# Altium schematic sheet Pg04_ AM335X Section 3 .SchDoc: PROCESSOR 3 OF 3
size A2; DrawnBy: RvS; DocumentNumber: 4; SheetNumber: 4; SheetTotal: 16
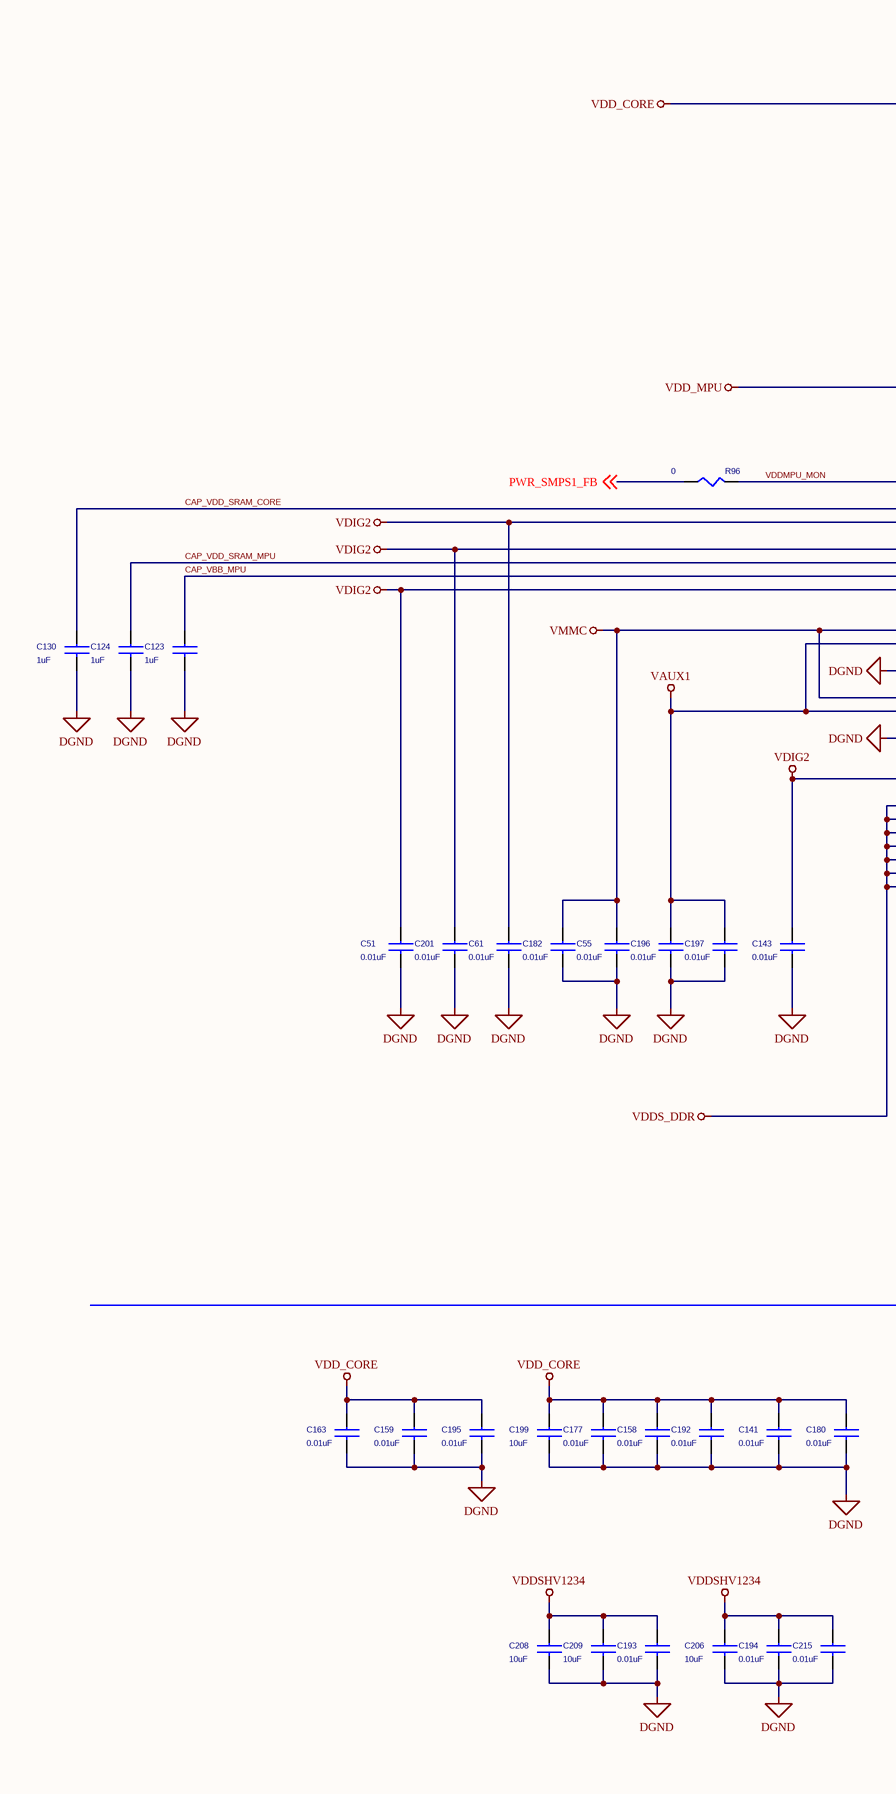
[diagram p0: Pg04_ AM335X Section 3 .SchDoc, left]
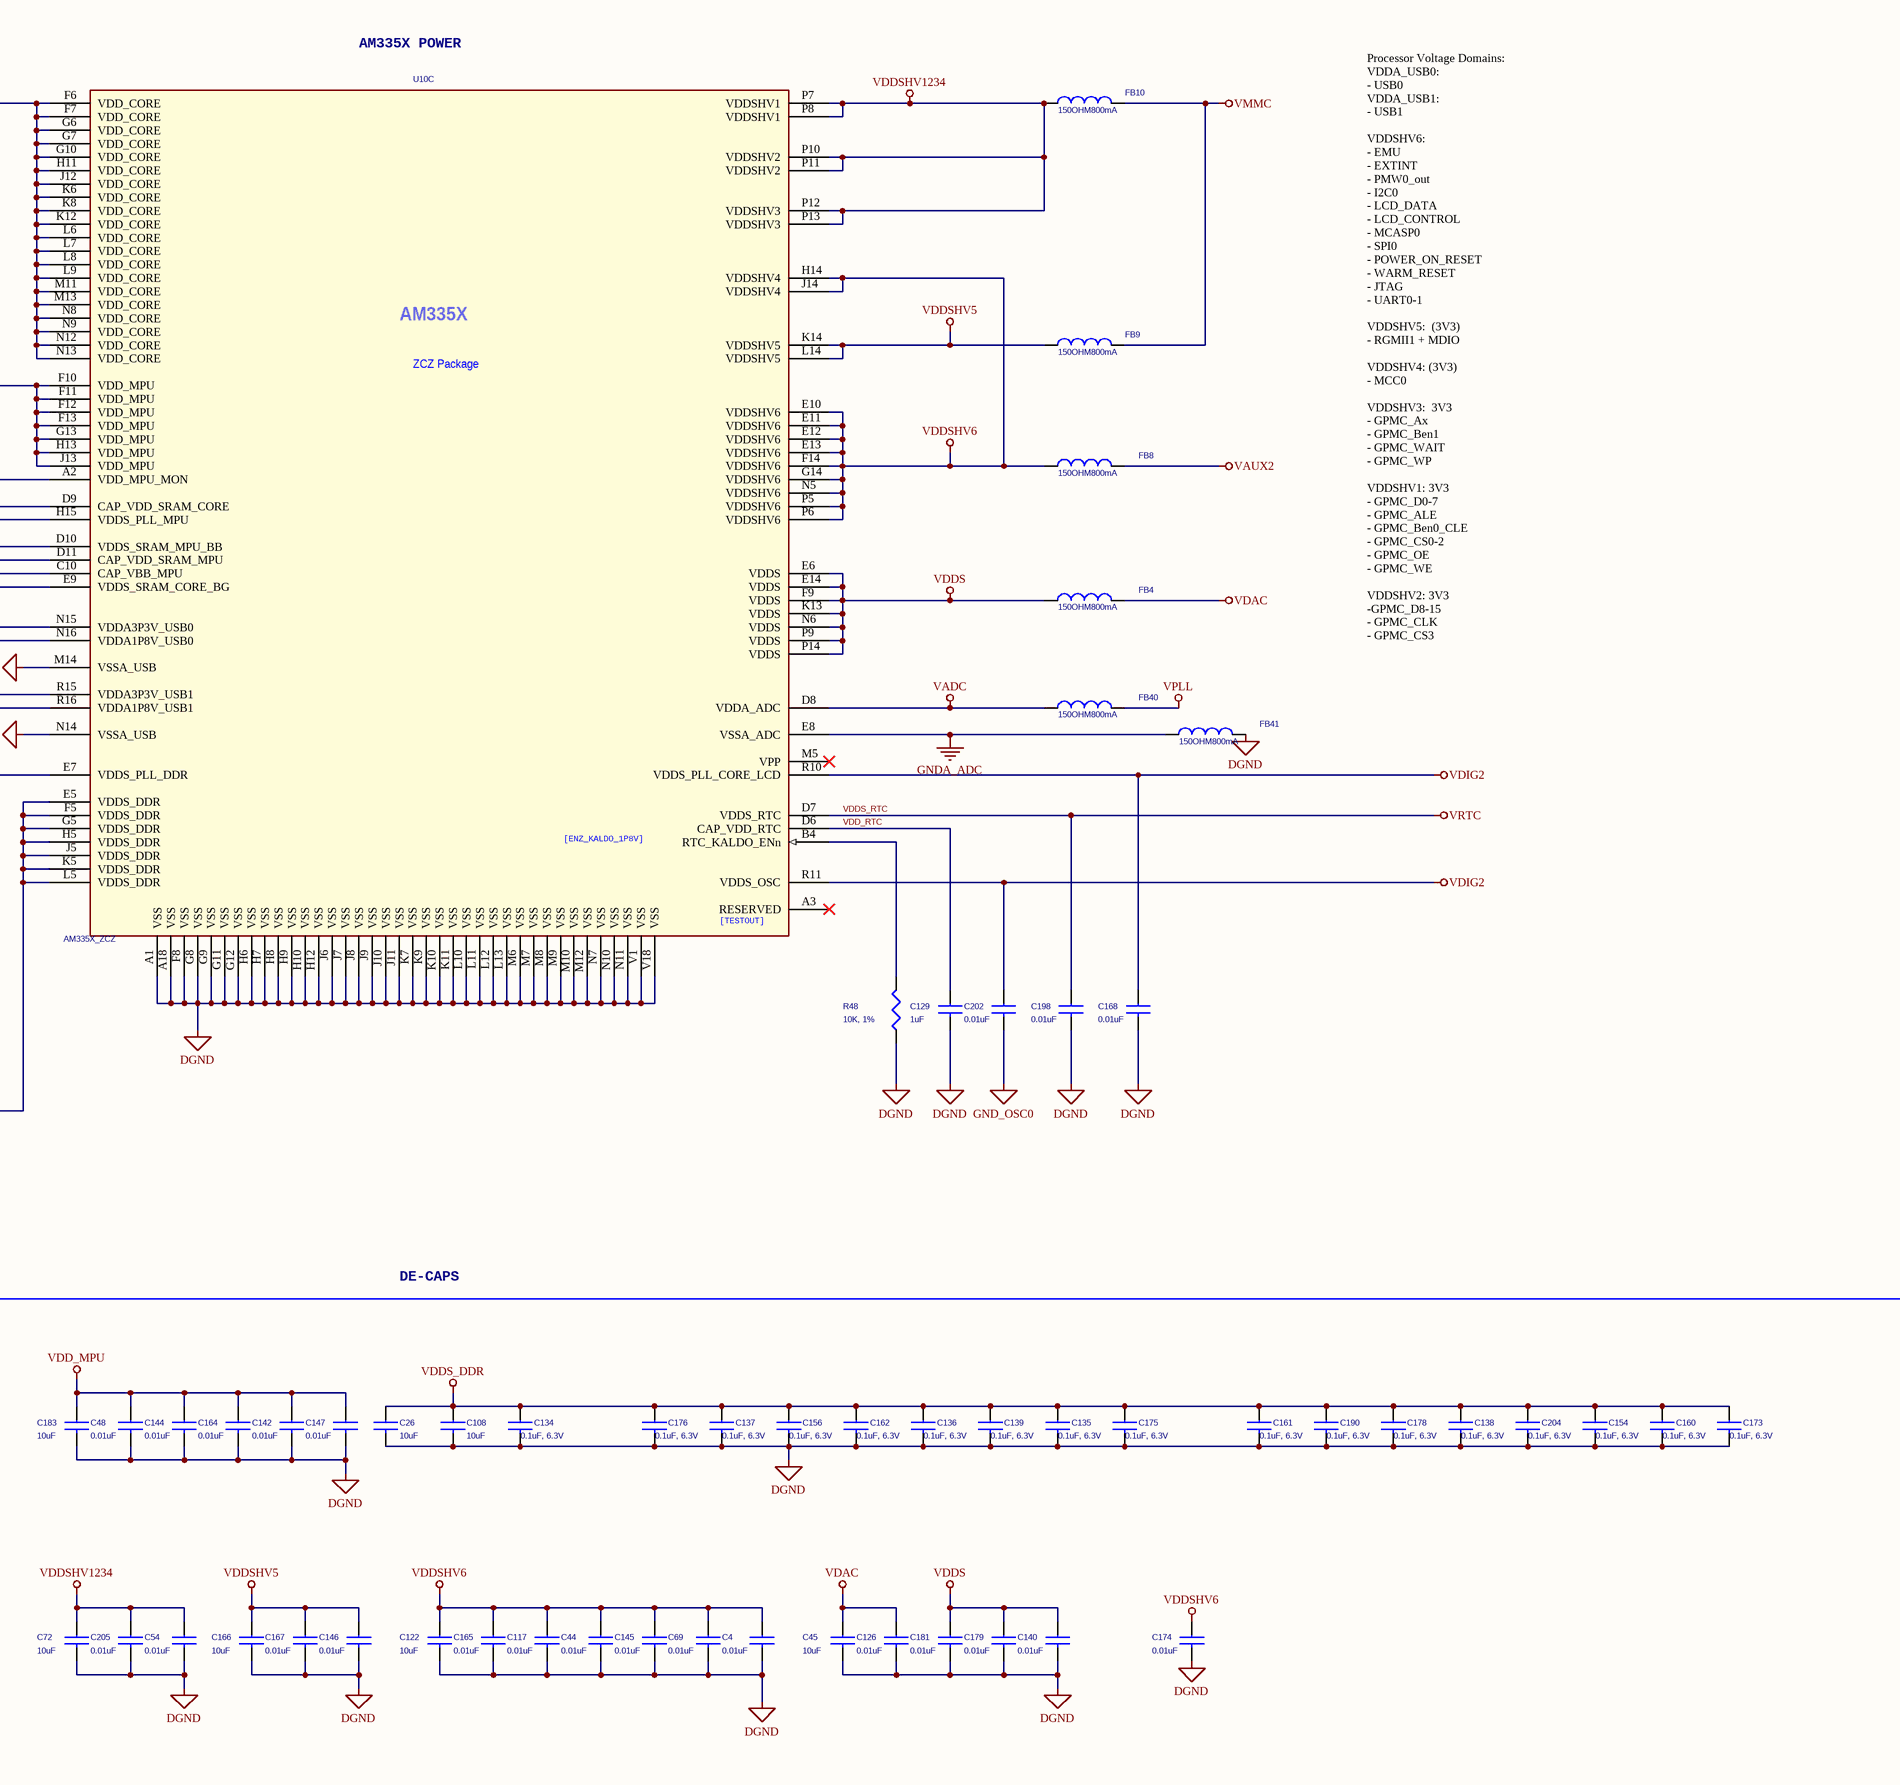
[diagram p1: Pg04_ AM335X Section 3 .SchDoc, right]

## Parts
?  (no value)  (graphical)
C4  0.01uF  [SM-7351-CAP-0402]
C26  10uF  [SM-7351-CAP-0805]
C44  0.01uF  [SM-7351-CAP-0402]
C45  10uF  [SM-7351-CAP-0805]
C48  0.01uF  [SM-7351-CAP-0402]
C51  0.01uF  [SM-7351-CAP-0402]
C54  0.01uF  [SM-7351-CAP-0402]
C55  0.01uF  [SM-7351-CAP-0402]
C61  0.01uF  [SM-7351-CAP-0402]
C69  0.01uF  [SM-7351-CAP-0402]
C72  10uF  [SM-7351-CAP-0805]
C108  10uF  [SM-7351-CAP-0805]
C117  0.01uF  [SM-7351-CAP-0402]
C122  10uF  [SM-7351-CAP-0805]
C123  1uF  [SM-7351-CAP-0402]
C124  1uF  [SM-7351-CAP-0402]
C126  0.01uF  [SM-7351-CAP-0402]
C129  1uF  [SM-7351-CAP-0402]
C130  1uF  [SM-7351-CAP-0402]
C134  0.1uF, 6.3V  [SM-7351-CAP-0402]
C135  0.1uF, 6.3V  [SM-7351-CAP-0402]
C136  0.1uF, 6.3V  [SM-7351-CAP-0402]
C137  0.1uF, 6.3V  [SMD0201]
C138  0.1uF, 6.3V  [SMD0201]
C139  0.1uF, 6.3V  [SMD0201]
C140  0.01uF  [SM-7351-CAP-0402]
C141  0.01uF  [SM-7351-CAP-0402]
C142  0.01uF  [SM-7351-CAP-0402]
C143  0.01uF  [SM-7351-CAP-0402]
C144  0.01uF  [SM-7351-CAP-0402]
C145  0.01uF  [SM-7351-CAP-0402]
C146  0.01uF  [SM-7351-CAP-0402]
C147  0.01uF  [SM-7351-CAP-0402]
C154  0.1uF, 6.3V  [SMD0201]
C156  0.1uF, 6.3V  [SMD0201]
C158  0.01uF  [SM-7351-CAP-0402]
C159  0.01uF  [SM-7351-CAP-0402]
C160  0.1uF, 6.3V  [SMD0201]
C161  0.1uF, 6.3V  [SMD0201]
C162  0.1uF, 6.3V  [SMD0201]
C163  0.01uF  [SM-7351-CAP-0402]
C164  0.01uF  [SM-7351-CAP-0402]
C165  0.01uF  [SM-7351-CAP-0402]
C166  10uF  [SM-7351-CAP-0805]
C167  0.01uF  [SM-7351-CAP-0402]
C168  0.01uF  [SM-7351-CAP-0402]
C173  0.1uF, 6.3V  [SMD0201]
C174  0.01uF  [SM-7351-CAP-0402]
C175  0.1uF, 6.3V  [SMD0201]
C176  0.1uF, 6.3V  [SMD0201]
C177  0.01uF  [SM-7351-CAP-0402]
C178  0.1uF, 6.3V  [SMD0201]
C179  0.01uF  [SM-7351-CAP-0402]
C180  0.01uF  [SM-7351-CAP-0402]
C181  0.01uF  [SM-7351-CAP-0402]
C182  0.01uF  [SM-7351-CAP-0402]
C183  10uF  [SM-7351-CAP-0805]
C190  0.1uF, 6.3V  [SM-7351-CAP-0402]
C192  0.01uF  [SM-7351-CAP-0402]
C193  0.01uF  [SM-7351-CAP-0402]
C194  0.01uF  [SM-7351-CAP-0402]
C195  0.01uF  [SM-7351-CAP-0402]
C196  0.01uF  [SM-7351-CAP-0402]
C197  0.01uF  [SM-7351-CAP-0402]
C198  0.01uF  [SM-7351-CAP-0402]
C199  10uF  [SM-7351-CAP-0805]
C201  0.01uF  [SM-7351-CAP-0402]
C202  0.01uF  [SM-7351-CAP-0402]
C204  0.1uF, 6.3V  [SM-7351-CAP-0402]
C205  0.01uF  [SM-7351-CAP-0402]
C206  10uF  [SM-7351-CAP-0805]
C208  10uF  [SM-7351-CAP-0805]
C209  10uF  [SM-7351-CAP-0805]
C215  0.01uF  [SM-7351-CAP-0402]
FB4  150OHM800mA  [sm-7351-ind-0805]
FB8  150OHM800mA  [sm-7351-ind-0805]
FB9  150OHM800mA  [sm-7351-ind-0805]
FB10  150OHM800mA  [sm-7351-ind-0805]
FB40  150OHM800mA  [sm-7351-ind-0805]
FB41  150OHM800mA  [sm-7351-ind-0805]
R48  10K, 1%  [SM-7351-RES-0402]
R96  0  [SM-7351-RES-0402]
U10  AM335X_ZCZ  [BGA15X15-324-55M]  (part C of 3)

## Nets
DGND: C4.2 C26.2 C44.2 C45.2 C48.2 C51.2 C54.2 C55.2 C61.2 C69.2 C72.2 C108.2 C117.2 C122.2 C123.2 C124.2 C126.2 C129.2 C130.2 C134.2 C135.2 C136.2 C137.2 C138.2 C139.2 C140.2 C141.2 C142.2 C143.2 C144.2 C145.2 C146.2 C147.2 C154.2 C156.2 C158.2 C159.2 C160.2 C161.2 C162.2 C163.2 C164.2 C165.2 C166.2 C167.2 C168.2 C173.2 C174.2 C175.2 C176.2 C177.2 C178.2 C179.2 C180.2 C181.2 C182.2 C183.2 C190.2 C192.2 C193.2 C194.2 C195.2 C196.2 C197.2 C198.2 C199.2 C201.2 C204.2 C205.2 C206.2 C208.2 C209.2 C215.2 FB41.2 R48.1 U10.A1(VSS) U10.A18(VSS) U10.F8(VSS) U10.G8(VSS) U10.G9(VSS) U10.G11(VSS) U10.G12(VSS) U10.H6(VSS) U10.H7(VSS) U10.H8(VSS) U10.H9(VSS) U10.H10(VSS) U10.H12(VSS) U10.J6(VSS) U10.J7(VSS) U10.J8(VSS) U10.J9(VSS) U10.J10(VSS) U10.J11(VSS) U10.K7(VSS) U10.K9(VSS) U10.K10(VSS) U10.K11(VSS) U10.L10(VSS) U10.L11(VSS) U10.L12(VSS) U10.L13(VSS) U10.M6(VSS) U10.M7(VSS) U10.M8(VSS) U10.M9(VSS) U10.M10(VSS) U10.M12(VSS) U10.M14(VSSA_USB) U10.N7(VSS) U10.N10(VSS) U10.N11(VSS) U10.N14(VSSA_USB) U10.V1(VSS) U10.V18(VSS)
GND_OSC0: C202.2
GNDA_ADC: FB41.1 U10.E8(VSSA_ADC)
VADC: FB40.1 U10.D8(VDDA_ADC)
VAUX1: C196.1 C197.1 U10.N16(VDDA1P8V_USB0) U10.R16(VDDA1P8V_USB1)
VAUX2: FB8.2
VDAC: C45.1 C126.1 FB4.2
VDD_CORE: C141.1 C158.1 C159.1 C163.1 C177.1 C180.1 C192.1 C195.1 C199.1 U10.F6(VDD_CORE) U10.F7(VDD_CORE) U10.G6(VDD_CORE) U10.G7(VDD_CORE) U10.G10(VDD_CORE) U10.H11(VDD_CORE) U10.J12(VDD_CORE) U10.K6(VDD_CORE) U10.K8(VDD_CORE) U10.K12(VDD_CORE) U10.L6(VDD_CORE) U10.L7(VDD_CORE) U10.L8(VDD_CORE) U10.L9(VDD_CORE) U10.M11(VDD_CORE) U10.M13(VDD_CORE) U10.N8(VDD_CORE) U10.N9(VDD_CORE) U10.N12(VDD_CORE) U10.N13(VDD_CORE)
VDD_MPU: C48.1 C142.1 C144.1 C147.1 C164.1 C183.1 U10.F10(VDD_MPU) U10.F11(VDD_MPU) U10.F12(VDD_MPU) U10.F13(VDD_MPU) U10.G13(VDD_MPU) U10.H13(VDD_MPU) U10.J13(VDD_MPU)
VDDS: C140.1 C179.1 C181.1 FB4.1 U10.E6(VDDS) U10.E14(VDDS) U10.F9(VDDS) U10.K13(VDDS) U10.N6(VDDS) U10.P9(VDDS) U10.P14(VDDS)
VDDS_DDR: C26.1 C108.1 C134.1 C135.1 C136.1 C137.1 C138.1 C139.1 C154.1 C156.1 C160.1 C161.1 C162.1 C173.1 C175.1 C176.1 C178.1 C190.1 C204.1 U10.E5(VDDS_DDR) U10.F5(VDDS_DDR) U10.G5(VDDS_DDR) U10.H5(VDDS_DDR) U10.J5(VDDS_DDR) U10.K5(VDDS_DDR) U10.L5(VDDS_DDR)
VDDS_RTC: C198.1 U10.D7(VDDS_RTC)  [also labelled VRTC]
VDDSHV5: C146.1 C166.1 C167.1 FB9.1 U10.K14(VDDSHV5) U10.L14(VDDSHV5)
VDDSHV6: C4.1 C44.1 C69.1 C117.1 C122.1 C145.1 C165.1 C174.1 FB8.1 U10.E10(VDDSHV6) U10.E11(VDDSHV6) U10.E12(VDDSHV6) U10.E13(VDDSHV6) U10.F14(VDDSHV6) U10.G14(VDDSHV6) U10.H14(VDDSHV4) U10.J14(VDDSHV4) U10.N5(VDDSHV6) U10.P5(VDDSHV6) U10.P6(VDDSHV6)
VDDSHV1234: C54.1 C72.1 C193.1 C194.1 C205.1 C206.1 C208.1 C209.1 C215.1 FB10.1 U10.P7(VDDSHV1) U10.P8(VDDSHV1) U10.P10(VDDSHV2) U10.P11(VDDSHV2) U10.P12(VDDSHV3) U10.P13(VDDSHV3)
VDIG2: C51.1 C61.1 C143.1 C168.1 C201.1 C202.1 U10.D10(VDDS_SRAM_MPU_BB) U10.E7(VDDS_PLL_DDR) U10.E9(VDDS_SRAM_CORE_BG) U10.H15(VDDS_PLL_MPU) U10.R10(VDDS_PLL_CORE_LCD) U10.R11(VDDS_OSC)
VMMC: C55.1 C182.1 FB9.2 FB10.2 U10.N15(VDDA3P3V_USB0) U10.R15(VDDA3P3V_USB1)
VPLL: FB40.2
CAP_VBB_MPU: C123.1 U10.C10(CAP_VBB_MPU)
CAP_VDD_SRAM_CORE: C130.1 U10.D9(CAP_VDD_SRAM_CORE)
CAP_VDD_SRAM_MPU: C124.1 U10.D11(CAP_VDD_SRAM_MPU)
PWR_SMPS1_FB: R96.2(P2) ; off-sheet PWR_SMPS1_FB
VDD_RTC: C129.1 U10.D6(CAP_VDD_RTC)
VDDMPU_MON: R96.1(P1) U10.A2(VDD_MPU_MON)
NetR48_2: R48.2 U10.B4(RTC_KALDO_ENn)

Not connected (* = marked no-connect by the designer): U10 A3(RESERVED)* M5(VPP)*

## Notes on the sheet
- (near U10) AM335X POWER
- Processor Voltage Domains:
  VDDA_USB0:
  - USB0
  VDDA_USB1:
  - USB1
  VDDSHV6:
  - EMU
  - EXTINT
  - PMW0_out
  - I2C0
  - LCD_DATA
  - LCD_CONTROL
  - MCASP0
  - SPI0
  - POWER_ON_RESET
  - WARM_RESET
  - JTAG
  - UART0-1
  VDDSHV5:  (3V3)
  - RGMII1 + MDIO
  VDDSHV4: (3V3)
  - MCC0
  VDDSHV3:  3V3
  - GPMC_Ax
  - GPMC_Ben1
  - GPMC_WAIT
  - GPMC_WP
  VDDSHV1: 3V3
  - GPMC_D0-7
  - GPMC_ALE
  - GPMC_Ben0_CLE
  - GPMC_CS0-2
  - GPMC_OE
  - GPMC_WE
  VDDSHV2: 3V3
  -GPMC_D8-15
  - GPMC_CLK
  - GPMC_CS3
- DE-CAPS
- Embedded Vision Systems Group
- Title
- School of Electrical and Electronic Engineering
- Date:
- Size
- Document Number
- Sheet
- of
- Rev
- (in symbol AM335X_15mmx15mm, part C) AM335X; ZCZ Package; [ENZ_KALDO_1P8V]; [TESTOUT]

## Library data of the parts
? = Title Block Address(1): UoM title block
C4 C44 C48 C51 C54 C55 C61 C69 C117 C126 C140-C147 C158 C159 C163-C165 C167 C168 C174 C177 C179-C182 C192-C198 C201 C202 C205 C215 = 0.01uFCapacitor16V10%0402_Dup1: Mfr: Panasonic; PartName: 0.01uF16V10%SMD0402; MfrNum: ECJ-0YB1C103K; TIIntPartnumber: 1C0012; PN: 0402YC103KAT2A; TN: 207-0054-000; Vendor: Digikey; Cost100: 0.00; Cost10K: 0.015; DescriptiveText: Capacitor 0.01uF 16V 10% 0402
C26 C45 C72 C108 C122 C166 C183 C199 C206 C208 C209 = 10uFCapacitor16V10%0805: Capacitor 10uF 16V 10% Ceramic 0805; PartName: 10uF16V10%SMD0805; Mfr: AVX; MfrNum: 0805YD106KAT2A; TIIntPartnumber: 1C0085; Vendor: Digikey; Cost100: 0.19; Cost10K: 0.042; Descriptive_Text: Capacitor 10uF 16V 10% Ceramic 0805; DescriptiveText: Capacitor 10uF 16V 10% Ceramic 0805
C123 C124 C129 C130 = 1uFCapacitor10V10%0402_Dup1: PartName: 1uF10V10%0402; Mfr: AVX; MfrNum: 0402ZD105KAT2A; TIIntPartnumber: 1C0084; Vendor: Digikey; Cost100: 0.336; Cost10K: 0.201; DescriptiveText: Capacitor 1uF 10V Ceramic 10% 0402
C134-C139 C154 C156 C160-C162 C173 C175 C176 C178 C190 C204 = 0.1uFCapacitor6.3V10%0201: PartName: 0.1uF6.3V10%smd0201; Mfr: Murata; MfrNum: GRM033R60J104KE19D; TIIntPartnumber: 1C0122; Vendor: Digikey; Cost100: 0.029; Cost10K: 0.0090; DescriptiveText: Capacitor 0.1uF 6.3V 10% 0201 X5R
FB4 FB8 FB40 FB41 = FerBead_12: Ferrite Bead 150 Ohm 800mA; Mfr: Steward; MfrNum: LI0805H151R-10; TIIntPartnumber: 1L0010; Vendor: Digikey; Cost100: 0.068; Cost10K: 0.045; DescriptiveText: Ferrite Bead 150 Ohm 800mA; PartName: FerriteBead150ohm800mA; Descriptive_Text: Ferrite Bead 150 Ohm 800mA
FB9 = FerBead_11: Ferrite Bead 150 Ohm 800mA; Mfr: Steward; MfrNum: LI0805H151R-10; TIIntPartnumber: 1L0010; Vendor: Digikey; Cost100: 0.068; Cost10K: 0.045; DescriptiveText: Ferrite Bead 150 Ohm 800mA; PartName: FerriteBead150ohm800mA; Descriptive_Text: Ferrite Bead 150 Ohm 800mA
FB10 = FerBead_7: Ferrite Bead 150 Ohm 800mA; Mfr: Steward; MfrNum: LI0805H151R-10; TIIntPartnumber: 1L0010; Vendor: Digikey; Cost100: 0.068; Cost10K: 0.045; DescriptiveText: Ferrite Bead 150 Ohm 800mA; PartName: FerriteBead150ohm800mA; Descriptive_Text: Ferrite Bead 150 Ohm 800mA
R48 = 10KOhmResistor1/10W1%0402_Dup2: TIIntPartnumber: 1R0254; MfrNum: ERJ-2RKF1002X; Mfr: PANASONIC-ECG; PartName: 10Kohm1/10W1%smd0402; DescriptiveText: Resistor 10Kohm 1/10W 1% 0402; Cost10K: 0.00291; Cost100: 0.011; Vendor: DIGIKEY
R96 = ZeroOhmResistor1/16W0402_Dup4: Resistor Zero ohm Jumper 0402; TIIntPartnumber: 1R0098; MfrNum: ERJ-2GE0R00X; Mfr: Panasonic; PartName: ZeroohmSMD0402; Cost10K: 0.0020; Cost100: 0.08; Vendor: Digikey; Descriptive_Text: Resistor Zero ohm Jumper 0402; DescriptiveText: Resistor Zero ohm Jumper 0402
U10 = AM335X_15mmx15mm: TIIntPartnumber: 1A0242; MfrNum: XAM3359ZCZ; Mfr: TI; PartName: AM335X_15x15; Cost10K: 4.1; Cost100: 10.00; Vendor: Arrow; DescriptiveText: ARM MPU Cortex A8 Processor ZCZ Package